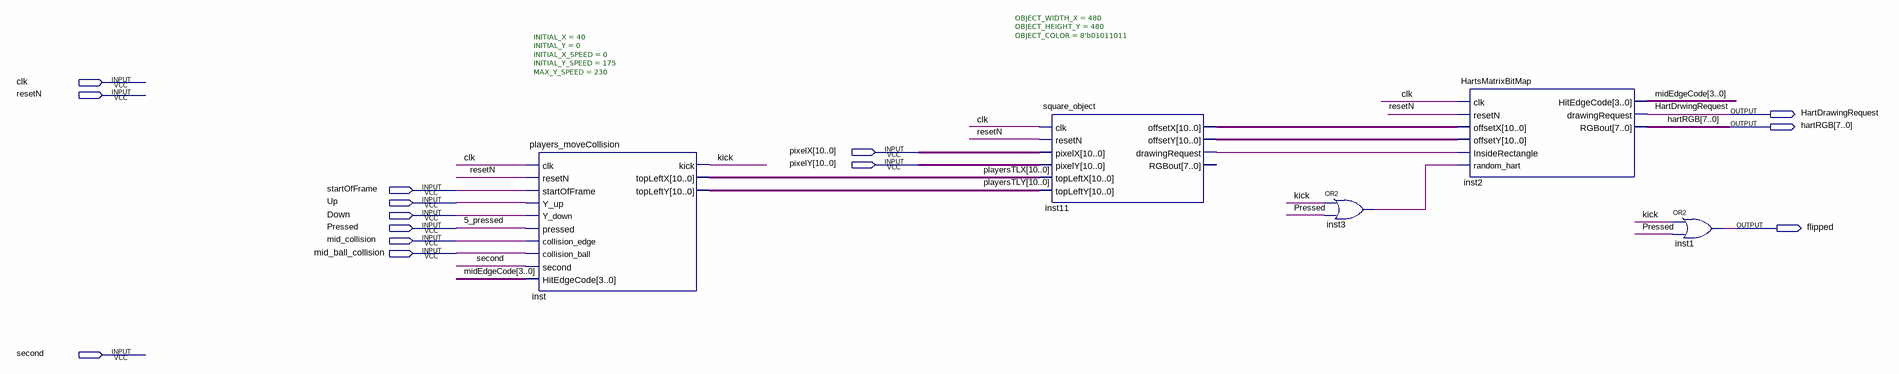
[diagram p0: schematic sheet]
// Quartus schematic mid_block.bdf as structural Verilog: 5 symbols, 14 pins
module mid_block (
  input  clk,
  input  resetN,
  input  [10:0] pixelX,
  input  [10:0] pixelY,
  input  startOfFrame,
  input  Up,
  input  Down,
  input  Pressed,
  input  mid_collision,
  input  mid_ball_collision,
  input  second,
  output HartDrawingRequest,
  output [7:0] hartRGB,
  output flipped
);

  wire inst3_out, inst11_drawingrequest, kick;
  wire [3:0] midEdgeCode;
  wire [10:0] inst11_offsetx, inst11_offsety, playersTLX, playersTLY;

  players_moveCollision #(.INITIAL_X(40), .INITIAL_Y(0), .INITIAL_X_SPEED(0), .INITIAL_Y_SPEED(175), .MAX_Y_SPEED(230)) inst (
    .clk(clk), .resetN(resetN), .startOfFrame(startOfFrame), .Y_up(Up), .Y_down(Down), .pressed(Pressed),
    .collision_edge(mid_collision), .collision_ball(mid_ball_collision), .second(second),
    .HitEdgeCode(midEdgeCode), .kick(kick), .topLeftX(playersTLX), .topLeftY(playersTLY));
  square_object #(.OBJECT_WIDTH_X(480), .OBJECT_HEIGHT_Y(480), .OBJECT_COLOR(8'b01011011)) inst11 (
    .clk(clk), .resetN(resetN), .pixelX(pixelX), .pixelY(pixelY), .topLeftX(playersTLX),
    .topLeftY(playersTLY), .offsetX(inst11_offsetx), .offsetY(inst11_offsety),
    .drawingRequest(inst11_drawingrequest));  // open: RGBout
  or inst3 (inst3_out, kick, Pressed);
  HartsMatrixBitMap inst2 (
    .clk(clk), .resetN(resetN), .offsetX(inst11_offsetx), .offsetY(inst11_offsety),
    .InsideRectangle(inst11_drawingrequest), .random_hart(inst3_out), .HitEdgeCode(midEdgeCode),
    .drawingRequest(HartDrawingRequest), .RGBout(hartRGB));
  or inst1 (flipped, kick, Pressed);

  // Other names for the same wires on the sheet: 5_pressed = Pressed; HartDrwingRequest = HartDrawingRequest
endmodule
